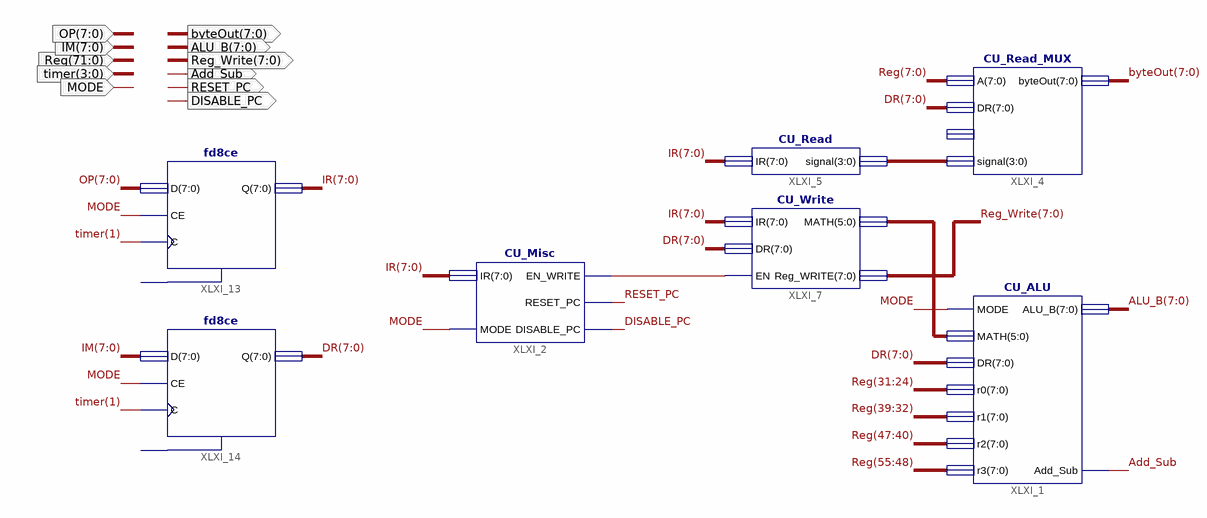
[diagram p0: schematic sheet 1]
// Xilinx ISE schematic ControlUnit.sch (spartan3e) as structural Verilog: 7 symbols, 11 ports
module ControlUnit (
  input  [7:0] IM,
  input  [7:0] OP,
  input  MODE,
  input  [71:0] Reg,
  input  [3:0] timer,
  output [7:0] byteOut,
  output [7:0] ALU_B,
  output Add_Sub,
  output [7:0] Reg_Write,
  output RESET_PC,
  output DISABLE_PC
);

  wire XLXN_57;
  wire [3:0] XLXN_3;
  wire [5:0] XLXN_4;
  wire [7:0] DR, IR;

  CU_Read XLXI_5 (.IR(IR), .signal(XLXN_3));
  CU_Read_MUX XLXI_4 (.A(Reg[7:0]), .DR(DR), .signal(XLXN_3), .byteOut(byteOut));  // open: ALU
  CU_ALU XLXI_1 (
    .MODE(MODE), .MATH(XLXN_4), .DR(DR), .r0(Reg[31:24]), .r1(Reg[39:32]), .r2(Reg[47:40]), .r3(Reg[55:48]),
    .ALU_B(ALU_B), .Add_Sub(Add_Sub));
  CU_Write XLXI_7 (.IR(IR), .DR(DR), .EN(XLXN_57), .MATH(XLXN_4), .Reg_WRITE(Reg_Write));
  CU_Misc XLXI_2 (.IR(IR), .MODE(MODE), .EN_WRITE(XLXN_57), .RESET_PC(RESET_PC), .DISABLE_PC(DISABLE_PC));
  fd8ce XLXI_13 (.C(timer[1]), .CE(MODE), .D(OP), .Q(IR));  // open: CLR
  fd8ce XLXI_14 (.C(timer[1]), .CE(MODE), .D(IM), .Q(DR));  // open: CLR
endmodule
